# Altium schematic sheet Main.SchDoc: Sencore IB: Main
size Letter; Organization: N Conrad; Revision: 20190822; SheetNumber: 1; SheetTotal: 3; Status: Prototype
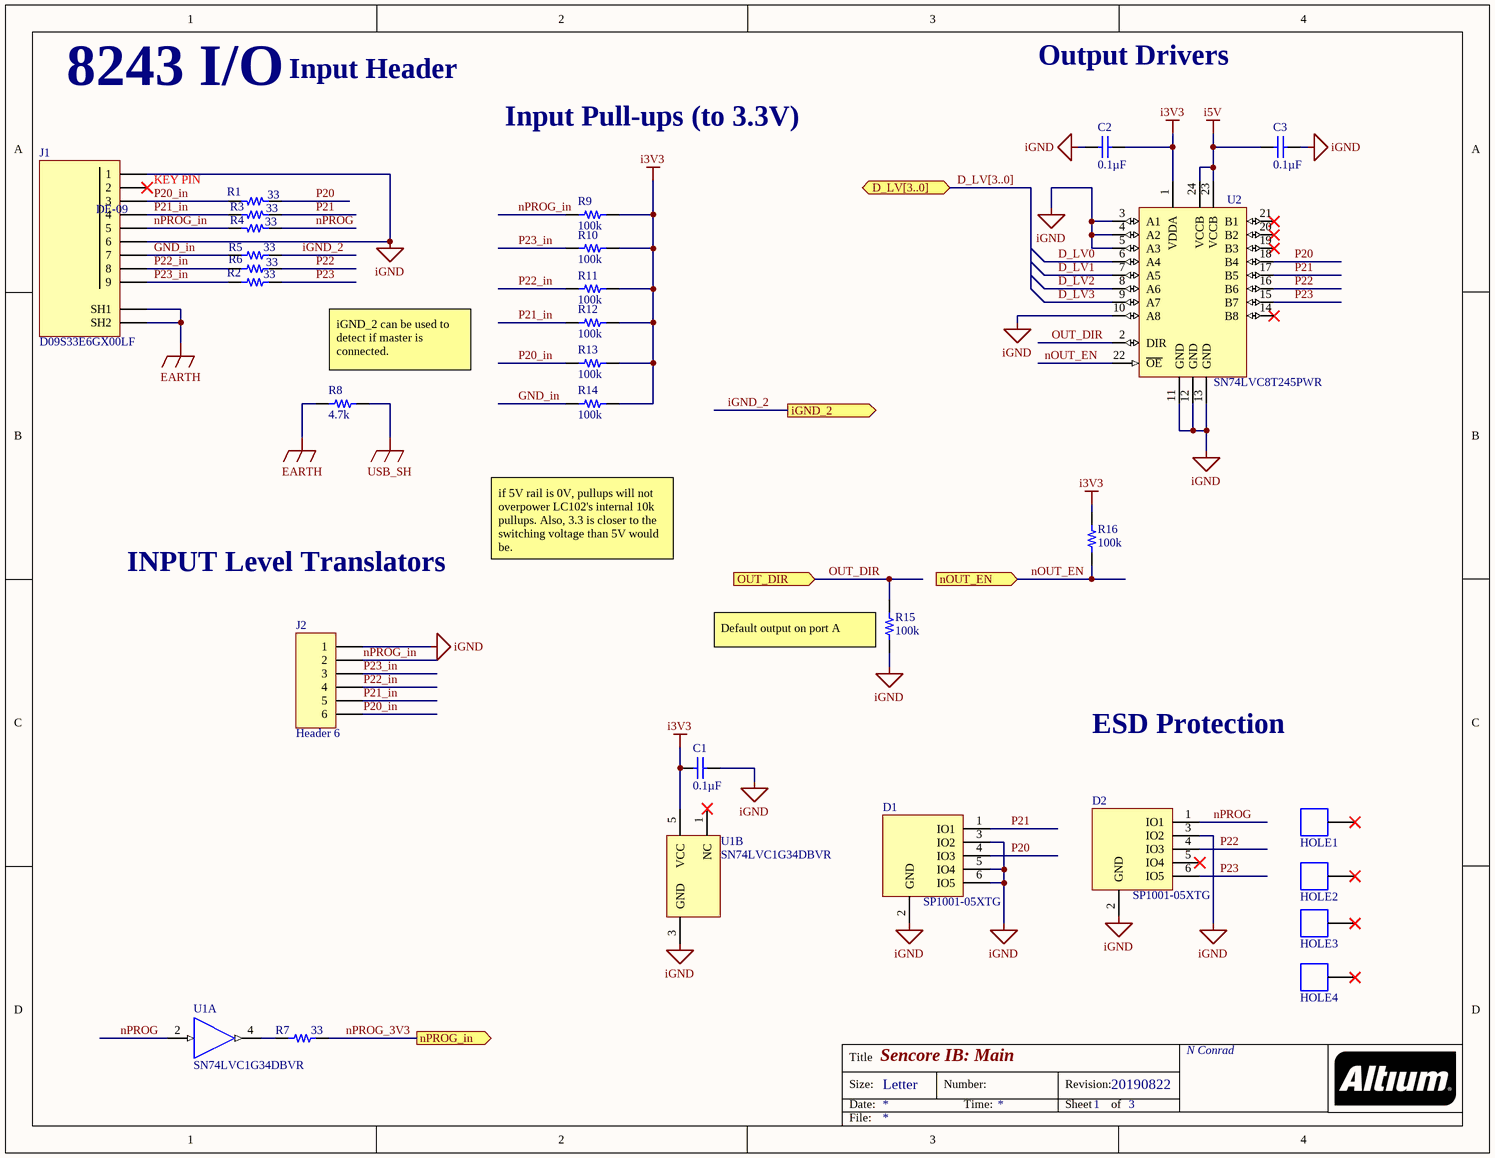
[diagram p0: Main.SchDoc]

## Parts
C1  value 0.1µF  [CAPC1608X09L_GRM]  (hidden comment: Capacitor)
C2  value 0.1µF  [CAPC1608X09L_GRM]  (hidden comment: Capacitor)
C3  value 0.1µF  [CAPC1608X09L_GRM]  (hidden comment: Capacitor)
D1  SP1001-05XTG  [SOTFL50P160X60-6N_Littlefuse_SOT563]
D2  SP1001-05XTG  [SOTFL50P160X60-6N_Littlefuse_SOT563]
HOLE1  HOLE_1285  [HOLE_128.5]  (value not drawn)  (no BOM)
HOLE2  HOLE_1285  [HOLE_128.5]  (value not drawn)  (no BOM)
HOLE3  HOLE_1285  [HOLE_128.5]  (value not drawn)  (no BOM)
HOLE4  HOLE_1285  [HOLE_128.5]  (value not drawn)  (no BOM)
J1  D09S33E6GX00LF  [Amp_D09S33E6GX00LF]
J2  Header 6  [HDR1X6]
R1  33  [RESC1608X06L_Yageo0603]
R2  33  [RESC1608X06L_Yageo0603]
R3  33  [RESC1608X06L_Yageo0603]
R4  33  [RESC1608X06L_Yageo0603]
R5  33  [RESC1608X06L_Yageo0603]
R6  33  [RESC1608X06L_Yageo0603]
R7  33  [RESC1608X06L_Yageo0603]
R8  4.7k  [RESC3116X07N_Yageo_RC1206]
R9  100k  [RESC1608X06L_Yageo0603]
R10  100k  [RESC1608X06L_Yageo0603]
R11  100k  [RESC1608X06L_Yageo0603]
R12  100k  [RESC1608X06L_Yageo0603]
R13  100k  [RESC1608X06L_Yageo0603]
R14  100k  [RESC1608X06L_Yageo0603]
R15  100k  [RESC1608X06L_Yageo0603]
R16  100k  [RESC1608X06L_Yageo0603]
U1  SN74LVC1G34DBVR  [DBV0005A_M]  (parts A,B of 2)
U2  SN74LVC8T245PWR  [TSOP65P640X120-24N_TI_PW]

## Ports
D_LV[3..0] (bidir), iGND_2 (out), nOUT_EN (in), nPROG_in (out), OUT_DIR (in)

## Nets
EARTH: J1.10(SH1) J1.11(SH2) R8.2
i3V3: C1.1 C2.2 R9.1 R10.1 R11.1 R12.1 R13.1 R14.1 R16.2 U1.5(VCC) U2.1(VDDA)
i5V: C3.2 U2.23(VCCB) U2.24(VCCB)
iGND: C1.2 C2.1 C3.1 D1.2(GND) D1.3(IO2) D1.5(IO4) D1.6(IO5) D2.2(GND) D2.3(IO2) J1.1 J1.6 J2.1 R15.1 U1.3(GND) U2.3(A1) U2.4(A2) U2.5(A3) U2.10(A8) U2.11(GND) U2.12(GND) U2.13(GND)
USB_SH: R8.1
D_LV0: U2.6(A4)
D_LV1: U2.7(A5)
D_LV2: U2.8(A6)
D_LV3: U2.9(A7)
GND_in: J1.7 R5.1 R14.2
iGND_2: R5.2 ; port iGND_2
nOUT_EN: R16.1 U2.22(~{OE}) ; port nOUT_EN
nPROG: D2.1(IO1) R4.2 U1.2(A)
nPROG_3V3: R7.2 ; port nPROG_in
nPROG_in: J1.5 J2.2 R4.1 R9.2
OUT_DIR: R15.2 U2.2(DIR) ; port OUT_DIR
P20: D1.4(IO3) R1.2 U2.18(B4)
P20_in: J1.3 J2.6 R1.1 R13.2
P21: D1.1(IO1) R3.2 U2.17(B5)
P21_in: J1.4 J2.5 R3.1 R12.2
P22: D2.4(IO3) R6.2 U2.16(B6)
P22_in: J1.8 J2.4 R6.1 R11.2
P23: D2.6(IO5) R2.2 U2.15(B7)
P23_in: J1.9 J2.3 R2.1 R10.2
NetR7_1: R7.1 U1.4(Y)

Not connected (* = marked no-connect by the designer): D2 5(IO4)*; HOLE1 1(MH3)*; HOLE2 1(MH3)*; HOLE3 1(MH3)*; HOLE4 1(MH3)*; J1 2*; U1 1(NC)*; U2 14(B8)* 19(B3)* 20(B2)* 21(B1)*

## Buses and harness runs
bus D_LV[3..0] = port D_LV[3..0]

## Notes on the sheet
- 8243 I/O
- Input Header
- Output Drivers
- Input Pull-ups (to 3.3V)
- KEY PIN
- (near R8) iGND_2 can be used to detect if master is connected.
- if 5V rail is 0V, pullups will not overpower LC102's internal 10k pullups. Also, 3.3 is closer to the switching voltage than 5V would be.
- INPUT Level Translators
- (near R15) Default output on port A
- ESD Protection
- Title
- Size:
- Date:
- Letter
- Number:
- Time:
- Revision:
- Sheet
- of
- File:
- (in symbol D09S33E6GX00LF) DE-09

## Library data of the parts
C1-C3 = GCJ188R71H104KA12D: CAP CER 0.1UF 50V X7R 0603; Manufacturer 1: Murata Electronics North America; Manufacturer Lifecycle 1: Active; Factory Stock: 0; Minimum Quantity: 1; Tolerance: ±10%; Unit Price (USD): 0.31000; Part Number: GCJ188R71H104KA12D; Applications: Automotive, Boardflex Sensitive; ComponentLink1Description: Datasheet; ComponentLink1URL: https://www.murata.com/~/media/webrenewal/support/library/catalog/products/capacitor/mlcc/c03e.ashx?la=en-us; Supplier Part Number 1: 490-5798-1-ND; Features: Soft Termination; Image: https://media.digikey.com/Renders/Murata%20Renders/0603%28LQG18%29.jpg; Manufacturer Part Number 1: GCJ188R71H104KA12D; Mounting Type: Surface Mount, MLCC; Operating Temperature: -55°C ~ 125°C; Package / Case: 0603 (1608 Metric); Packaging: Cut Tape (CT); Stock 1: 2693341; Ratings: AEC-Q200; Series: GCJ; Size / Dimension: 0.063" L x 0.031" W (1.60mm x 0.80mm); Supplier 1: Digi-Key; Temperature Coefficient: X7R; Thickness (Max): 0.035" (0.90mm); Voltage - Rated: 50V
D1 D2 = SP1001-05XTG: TVS DIODE 5.5VWM 13VC SOT563; Manufacturer: Littelfuse; Direction: Unidirectional; Capacitance: 12pF; Operating Supply Voltage: 5.5V; Max Surge Current: 2A; Number of Unidirectional Channels: 5; Min Breakdown Voltage: 7V; Clamping Voltage: 13V; Power Line Protection: No; Leakage Current: 500nA; Supplier 1: Digi-Key; Supplier Part Number 1: F2898CT-ND; Stock 1: 21783; Pricing 1: 1=0.60000, 10=0.52700, 25=0.49480, 100=0.40390, 250=0.37516, 500=0.31930, 1000=0.25544 (USD); RoHS: Yes; Mount: Surface Mount; Case/Package: SOT-563; Number of Pins: 6; Min Operating Temperature: -40°C; Max Operating Temperature: 85°C; Package Quantity: 3000; Packaging: Tape and Reel; Reverse Standoff Voltage: 5.5V; Polarity: Unidirectional; Number of Channels: 5; Breakdown Voltage: 5.5V; Termination: SMD/SMT; Working Voltage: 5.5V; Number of Elements: 5; Peak Pulse Current: 2A; Composition: Zener; Length: 1.7mm; Depth: 1.3mm; Radiation Hardening: No; REACH SVHC: No SVHC; Lead Free: Lead Free; ComponentLink1URL: https://datasheet.ciiva.com/26935/getdatasheetpartid-476468-26935914.pdf?src-supplier=Verical; ComponentLink1Description: https://datasheet.ciiva.com/26935/getdatasheetpartid-476468-26935914.pdf?src-supplier=Verical; ComponentLink2URL: https://datasheet.ciiva.com/331/littelfuse-tvs-diode-array-sp1001-datasheet-pdf-331875.pdf?src-supplier=Digi-Key; ComponentLink2Description: https://datasheet.ciiva.com/331/littelfuse-tvs-diode-array-sp1001-datasheet-pdf-331875.pdf?src-supplier=Digi-Key; ComponentLink3URL: https://datasheet.ciiva.com/46428/littelfuse-spa-sp1001-0x-46428677.pdf?src-supplier=Element14; ComponentLink3Description: https://datasheet.ciiva.com/46428/littelfuse-spa-sp1001-0x-46428677.pdf?src-supplier=Element14; ComponentLink4URL: https://datasheet.ciiva.com/22637/685841-22637994.pdf?src-supplier=Element14; ComponentLink4Description: https://datasheet.ciiva.com/22637/685841-22637994.pdf?src-supplier=Element14; ComponentLink5URL: https://datasheet.ciiva.com/1219/685841-1219791.pdf?src-supplier=Newark; ComponentLink5Description: https://datasheet.ciiva.com/1219/685841-1219791.pdf?src-supplier=Newark; ComponentLink6URL: https://datasheet.ciiva.com/331/littelfuse-tvs-diode-array-sp1001-datasheet-pdf-331874.pdf?src-supplier=Digi-Key; ComponentLink6Description: https://datasheet.ciiva.com/331/littelfuse-tvs-diode-array-sp1001-datasheet-pdf-331874.pdf?src-supplier=Digi-Key; ComponentLink7URL: https://datasheet.ciiva.com/331/littelfuse-tvs-diode-array-sp1001-datasheet-pdf-331876.pdf?src-supplier=Digi-Key; ComponentLink7Description: https://datasheet.ciiva.com/331/littelfuse-tvs-diode-array-sp1001-datasheet-pdf-331876.pdf?src-supplier=Digi-Key; Manufacturer Part Number: SP1001-05XTG
J1 = D09S33E6GX00LF: Conn D-Subminiature SKT 9 POS 2.74mm Solder RA Thru-Hole 9 Terminal 1 Port; Manufacturer 1: Amphenol FCI; Gender: Female; Voltage Rating: 300V; Current Rating: 5A; Connector Type: D-Sub,Receptacle,Signal; Number of Positions: 9; Number of Ports: 1; Supplier 1: Digi-Key; Supplier Part Number 1: 609-6160-ND; Stock 1: 490; Pricing 1: 1=1.43000, 10=1.29600, 30=1.21633, 60=1.16350, 120=1.11067, 270=1.00493, 510=0.92557, 1020=0.79335, 2520=0.74046 (USD); RoHS: Yes; Mount: Through Hole; Contact Plating: Gold,GXT,Tin,Matte; Housing Material: PBT; Color: Black; Number of Terminals: 9; Min Operating Temperature: -55°C; Max Operating Temperature: 125°C; Termination: Solder; Orientation: Right Angle; Number of Rows: 2; Packaging: Tray; Max Voltage Rating (AC): 300V; Max Supply Voltage (AC): 300V; Length: 30.81mm; Pitch: 2.74mm; Depth: 18.77mm; Radiation Hardening: No; ComponentLink1URL: https://datasheet.ciiva.com/15177/getdatasheetpartid-65084-15177347.pdf?src-supplier=Verical; ComponentLink1Description: https://datasheet.ciiva.com/15177/getdatasheetpartid-65084-15177347.pdf?src-supplier=Verical; Manufacturer Part Number 1: D09S33E6GX00LF
J2 = Header 6: Header, 6-Pin; LatestRevisionDate: 17-Jul-2002; LatestRevisionNote: Re-released for DXP Platform.; Publisher: Altium Limited
R1-R7 = RC0603JR-0733RL: RES SMD 33 OHM 5% 1/10W 0603; Manufacturer 1: Yageo; Manufacturer Lifecycle 1: Active; Factory Stock: 0; Minimum Quantity: 1; Power (Watts): 0.1W, 1/10W; Temperature Coefficient: ±100ppm/°C; Unit Price (USD): 0.10000; Value: 33; Part Number: RC0603JR-0733RL; ComponentLink1Description: Datasheet; Composition: Thick Film; ComponentLink1URL: http://www.yageo.com/documents/recent/PYu-RC_Group_51_RoHS_L_9.pdf; Supplier Part Number 1: 311-33GRCT-ND; Features: Moisture Resistant; Height - Seated (Max): 0.022" (0.55mm); Image: https://media.digikey.com/Renders/Yageo%20Renders/0603-(1608-Metric).jpg; Manufacturer Part Number 1: RC0603JR-0733RL; Number of Terminations: 2; Operating Temperature: -55°C ~ 155°C; Package / Case: 0603 (1608 Metric); Packaging: Cut Tape (CT); Stock 1: 0; Series: RC; Size / Dimension: 0.063" L x 0.032" W (1.60mm x 0.80mm); Supplier 1: Digi-Key; Supplier Device Package: 0603; Tolerance: ±5%
R8 = RC1206FR-074K7L: RES SMD 4.7K OHM 1% 1/4W 1206; Manufacturer 1: Yageo; Manufacturer Lifecycle 1: Active; Factory Stock: 0; Minimum Quantity: 1; Power (Watts): 0.25W, 1/4W; Temperature Coefficient: ±100ppm/°C; Unit Price (USD): 0.10000; Value: 4.7k; Part Number: RC1206FR-074K7L; ComponentLink1Description: Datasheet; Composition: Thick Film; ComponentLink1URL: http://www.yageo.com/documents/recent/PYu-RC_Group_51_RoHS_L_9.pdf; Supplier Part Number 1: 311-4.70KFRCT-ND; Features: Moisture Resistant; Height - Seated (Max): 0.026" (0.65mm); Image: https://media.digikey.com/Renders/Yageo%20Renders/1206-(3216-Metric).jpg; Manufacturer Part Number 1: RC1206FR-074K7L; Number of Terminations: 2; Operating Temperature: -55°C ~ 155°C; Package / Case: 1206 (3216 Metric); Packaging: Cut Tape (CT); Stock 1: 1326324; Series: RC; Size / Dimension: 0.122" L x 0.063" W (3.10mm x 1.60mm); Supplier 1: Digi-Key; Supplier Device Package: 1206; Tolerance: ±1%
R9-R16 = RC0603JR-07100KL: RES SMD 100K OHM 5% 1/10W 0603; Manufacturer 1: Yageo; Manufacturer Lifecycle 1: Active; Factory Stock: 0; Minimum Quantity: 1; Power (Watts): 0.1W, 1/10W; Temperature Coefficient: ±100ppm/°C; Unit Price (USD): 0.10000; Value: 100k; Part Number: RC0603JR-07100KL; ComponentLink1Description: Datasheet; Composition: Thick Film; ComponentLink1URL: http://www.yageo.com/documents/recent/PYu-RC_Group_51_RoHS_L_9.pdf; Supplier Part Number 1: 311-100KGRCT-ND; Features: Moisture Resistant; Height - Seated (Max): 0.022" (0.55mm); Image: https://media.digikey.com/Renders/Yageo%20Renders/0603-(1608-Metric).jpg; Manufacturer Part Number 1: RC0603JR-07100KL; Number of Terminations: 2; Operating Temperature: -55°C ~ 155°C; Package / Case: 0603 (1608 Metric); Packaging: Cut Tape (CT); Stock 1: 0; Series: RC; Size / Dimension: 0.063" L x 0.032" W (1.60mm x 0.80mm); Supplier 1: Digi-Key; Supplier Device Package: 0603; Tolerance: ±5%
U1 = CMP-0859-00026-3: Single Buffer Gate, DBV0005A, LARGE T&R; Manufacturer: Texas Instruments; F @ Nom Voltage(Max)(Mhz): 150; Technology Family: LVC; Output Drive (IOL/IOH)(Max)(mA): 32/-32; ICC @ Nom Voltage(Max)(mA): 0.001; Bits(#): 1; Sub-Family: Non-Inverting Buffer/Driver; Output Type: CMOS; Voltage(Nom)(V): 1.8,2.5,3.3,5; tpd @ Nom Voltage(Max)(ns): 8.6,4.4,4.1,3.2; Logic: True; Schmitt Trigger: No; Input Type: CMOS/TTL; Rating: Catalog; VCC(Max)(V): 5.5; VCC(Min)(V): 1.65; DatasheetVersion: SCES519L; Operating Temperature Range(C): -40 to 125,-40 to 85; PackageReference: DBV0005A; Generic Part Number: SN74LVC1G34; 3-State Output: No
U2 = SN74LVC8T245PWR: IC TRNSLTR BIDIRECTIONAL 24TSSOP; Manufacturer 1: Texas Instruments; Logic Function: Translator,Transceiver; Propagation Delay: 4.2ns; Min Supply Voltage: 1.65V; Max Supply Voltage: 5.5V; Number of Bits: 8; High Level Output Current: -32mA; Low Level Output Current: 32mA; Quiescent Current: 15uA; Number of Elements: 1; Data Rate: 500Mbps; Turn-On Delay Time: 32.2ns; Polarity: Non-Inverting; Operating Supply Voltage: 3.3V; Supplier 1: Digi-Key; Supplier Part Number 1: 296-18593-1-ND; Stock 1: 37113; Pricing 1: 1=1.05000, 10=0.93600, 100=0.72970, 500=0.60276, 1000=0.47586 (USD); RoHS: Yes; Mount: Surface Mount; Case/Package: TSSOP; Number of Pins: 24; Weight: 0.003157oz; Contact Plating: Gold; Min Operating Temperature: -40°C; Max Operating Temperature: 85°C; Package Quantity: 1; Packaging: Tape and Reel; Direction: Bidirectional; Number of Outputs: 8; Number of Channels: 8; Length: 7.9mm; Height: 1.05mm; Width: 4.5mm; Radiation Hardening: No; Lead Free: Lead Free; REACH SVHC: No SVHC; ComponentLink1URL: https://datasheet.ciiva.com/34301/1048559-34301923.pdf?src-supplier=Jameco; ComponentLink1Description: https://datasheet.ciiva.com/34301/1048559-34301923.pdf?src-supplier=Jameco; ComponentLink2URL: https://datasheet.ciiva.com/15086/getdatasheetpartid-48801-15086005.pdf?src-supplier=Verical; ComponentLink2Description: https://datasheet.ciiva.com/15086/getdatasheetpartid-48801-15086005.pdf?src-supplier=Verical; ComponentLink3URL: https://datasheet.ciiva.com/41455/001017232-da-01-en-ic-bus-8bit-sn74lvc8t245pwr-tssop-24-tid-41455868.pdf?src-supplier=Conrad; ComponentLink3Description: https://datasheet.ciiva.com/41455/001017232-da-01-en-ic-bus-8bit-sn74lvc8t245pwr-tssop-24-tid-41455868.pdf?src-supplier=Conrad; ComponentLink4URL: https://datasheet.ciiva.com/26867/sn74lvc8t245pwr-26867745.pdf?src-supplier=IIIC; ComponentLink4Description: https://datasheet.ciiva.com/26867/sn74lvc8t245pwr-26867745.pdf?src-supplier=IIIC; ComponentLink5URL: https://datasheet.ciiva.com/1899/sn74lvc8t245-1899395.pdf?src-supplier=Digi-Key; ComponentLink5Description: https://datasheet.ciiva.com/1899/sn74lvc8t245-1899395.pdf?src-supplier=Digi-Key; ComponentLink6URL: https://datasheet.ciiva.com/1899/sn74lvc8t245-1899396.pdf?src-supplier=Digi-Key; ComponentLink6Description: https://datasheet.ciiva.com/1899/sn74lvc8t245-1899396.pdf?src-supplier=Digi-Key; ComponentLink7URL: https://datasheet.ciiva.com/7795/1763937-7795013.pdf?src-supplier=Element14; ComponentLink7Description: https://datasheet.ciiva.com/7795/1763937-7795013.pdf?src-supplier=Element14; ComponentLink8URL: https://datasheet.ciiva.com/25973/sn74lvc8t245-25973803.pdf?src-supplier=Avnet+Europe; ComponentLink8Description: https://datasheet.ciiva.com/25973/sn74lvc8t245-25973803.pdf?src-supplier=Avnet+Europe; ComponentLink9URL: https://datasheet.ciiva.com/1899/sn74lvc8t245-1899397.pdf?src-supplier=Digi-Key; ComponentLink9Description: https://datasheet.ciiva.com/1899/sn74lvc8t245-1899397.pdf?src-supplier=Digi-Key; ComponentLink10URL: https://datasheet.ciiva.com/46439/1831204-46439647.pdf?src-supplier=Element14; ComponentLink10Description: https://datasheet.ciiva.com/46439/1831204-46439647.pdf?src-supplier=Element14; Manufacturer Part Number 1: SN74LVC8T245PWR